# Altium schematic sheet ST_LINK-Wiki.SchDoc
size A4
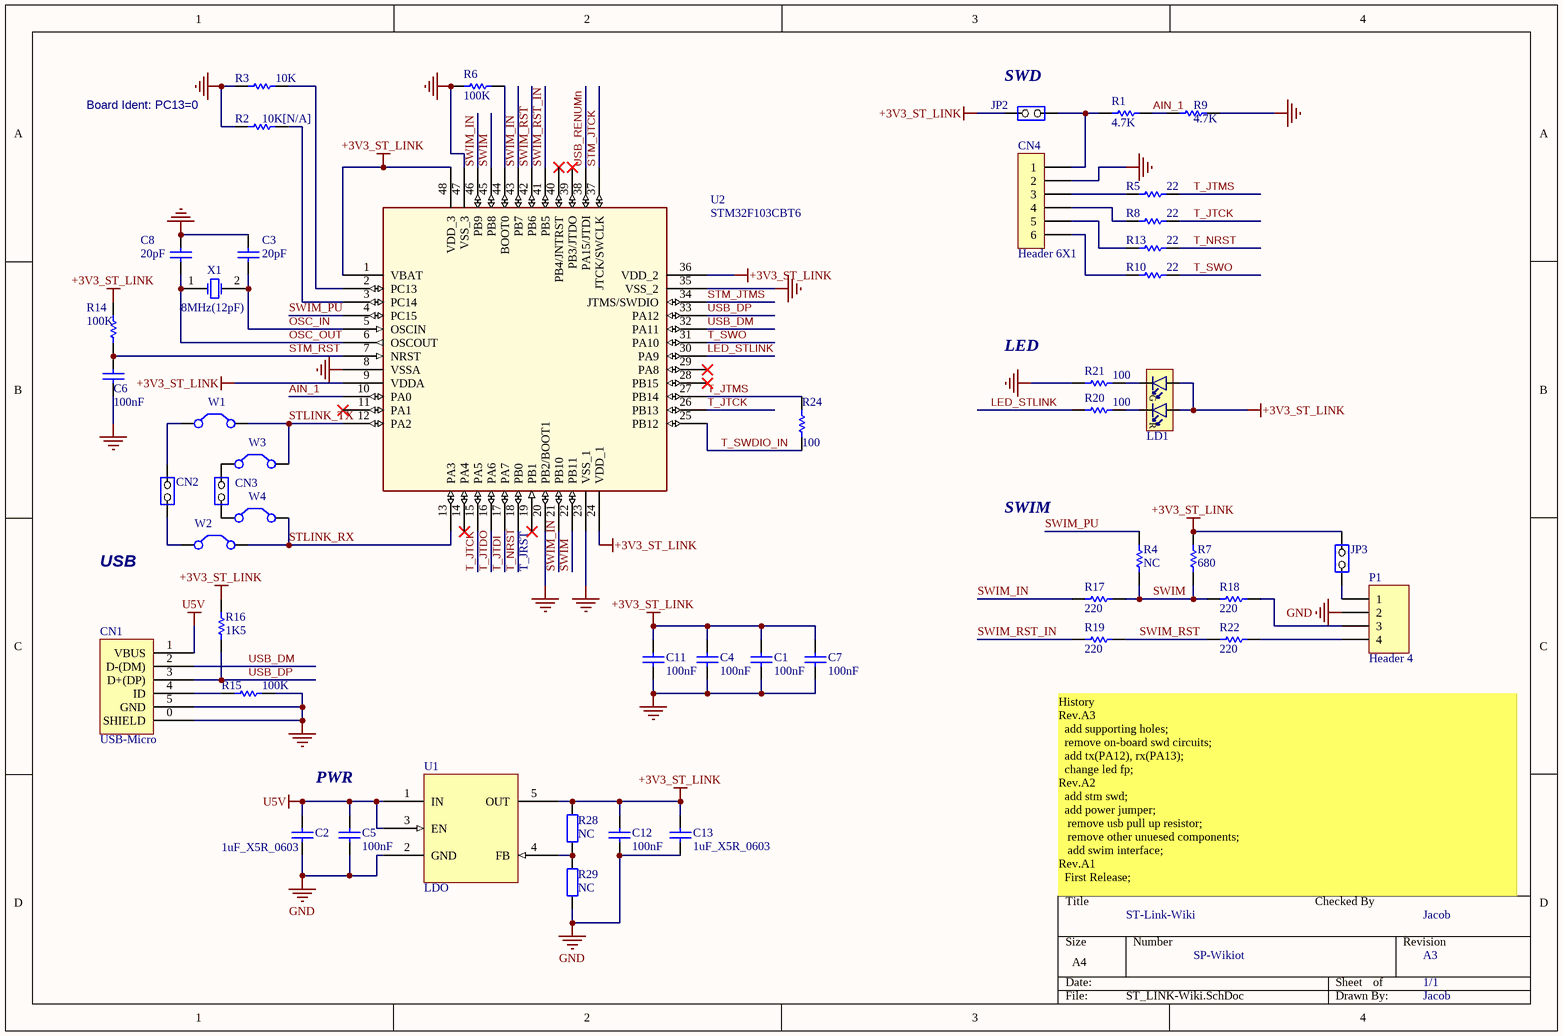
[diagram p0: ST_LINK-Wiki.SchDoc]

## Parts
C1  100nF  [0603C]
C2  1uF_X5R_0603  [0603C]
C3  20pF  [0603C]
C4  100nF  [0603C]
C5  100nF  [0603C]
C6  100nF  [0603C]
C7  100nF  [0603C]
C8  20pF  [0603C]
C11  100nF  [0603C]
C12  100nF  [0603C]
C13  1uF_X5R_0603  [0603C]
CN1  USB-Micro  [USB-MICRO-Lite]
CN2  (no value)  [HDR1X2-L/2.54MM]
CN3  (no value)  [HDR1X2-L/2.54MM]
CN4  Header 6X1  [HDR1X6-L/2.54MM]
JP2  (no value)  [HDR1X2/2.54mm]
JP3  (no value)  [HDR1X2/2.54mm]
LD1  LTST-C195KGJRKT  [0805-LED-Bi]  (value not drawn)
P1  Header 4  [HDR1X4-L/2.54MM]
R1  4.7K  [0603R]
R2  10K[N/A]  [0603R]
R3  10K  [0603R]
R4  NC  [0603R]
R5  22  [0603R]
R6  100K  [0603R]
R7  680  [0603R]
R8  22  [0603R]
R9  4.7K  [0603R]
R10  22  [0603R]
R13  22  [0603R]
R14  100K  [0603R]
R15  100K  [0603R]
R16  1K5  [0603R]
R17  220  [0603R]
R18  220  [0603R]
R19  220  [0603R]
R20  100  [0603R]
R21  100  [0603R]
R22  220  [0603R]
R24  100  [0603R]
R28  NC  [0603M]
R29  NC  [0603M]
U1  LDO  [SOT23-5]
U2  STM32F103CBT6  [QFP48 7X7]
W1  Jumper2-1  [JP2_SMD]  (value not drawn)
W2  Jumper2-1  [JP2_SMD]  (value not drawn)
W3  Jumper2-1  [JP2_SMD]  (value not drawn)
W4  Jumper2-1  [JP2_SMD]  (value not drawn)
X1  8MHz(12pF)  [XTAL1]

## Nets
+3V3_ST_LINK: C1.2 C4.2 C7.2 C11.2 C12.2 C13.1 JP2.1(COMMON) JP3.1(COMMON) LD1.3(A2) LD1.4(A1) R7.2 R14.2 R16.2 R28.1 U1.5(OUT) U2.1(VBAT) U2.9(VDDA) U2.24(VDD_1) U2.36(VDD_2) U2.48(VDD_3)
GND: C1.1 C2.1 C3.2 C4.1 C5.1 C6.1 C7.1 C8.2 C11.1 C12.1 C13.2 CN1.0(SHIELD) CN1.5(GND) CN4.2 P1.2 R2.1 R3.1 R6.1 R9.2 R15.2 R21.1 R29.1 U1.2(GND) U2.8(VSSA) U2.20(PB2/BOOT1) U2.23(VSS_1) U2.35(VSS_2) U2.47(VSS_3)
U5V: C2.2 C5.2 CN1.1(VBUS) U1.1(IN) U1.3(EN)
AIN_1: R1.1 R9.1 U2.10(PA0)
LED_STLINK: R20.1 U2.30(PA9)
OSC_IN: C3.1 U2.5(OSCIN) X1.2(OSC2)
OSC_OUT: C8.1 U2.6(OSCOUT) X1.1(OSC1)
STLINK_RX: U2.13(PA3) W2.2(C2) W4.2(C2)
STLINK_TX: U2.12(PA2) W1.2(C2) W3.2(C2)
STM_JTCK: U2.37(JTCK/SWCLK)
STM_JTMS: U2.34(JTMS/SWDIO)
STM_RST: C6.2 R14.1 U2.7(NRST)
SWIM: R4.1 R7.1 R17.2 R18.1 U2.22(PB11) U2.45(PB8)
SWIM_IN: R17.1 U2.21(PB10) U2.43(PB7) U2.46(PB9)
SWIM_PU: R4.2 U2.4(PC15)
SWIM_RST: R19.2 R22.1 U2.42(PB6)
SWIM_RST_IN: R19.1 U2.41(PB5)
T_JTCK: R8.2 U2.15(PA5) U2.26(PB13)
T_JTDI: U2.17(PA7)
T_JTDO: U2.16(PA6)
T_JTMS: R5.2 R24.2 U2.27(PB14)
T_NRST: R13.2 U2.18(PB0)
T_SWDIO_IN: R24.1 U2.25(PB12)
T_SWO: R10.2 U2.31(PA10)
USB_DM: CN1.2(D-(DM)) U2.32(PA11)
USB_DP: CN1.3(D+(DP)) R16.1 U2.33(PA12)
USB_RENUMn: U2.38(PA15/JTDI)
NetCN1_4: CN1.4(ID) R15.1
NetCN2_1: CN2.1(COMMON) W2.1(C1)
NetCN2_2: CN2.2(NO) W1.1(C1)
NetCN3_1: CN3.1(COMMON) W4.1(C1)
NetCN3_2: CN3.2(NO) W3.1(C1)
NetCN4_1: CN4.1 JP2.2(NO) R1.2
NetCN4_3: CN4.3 R5.1
NetCN4_4: CN4.4 R8.1
NetCN4_5: CN4.5 R13.1
NetCN4_6: CN4.6 R10.1
NetJP3_2: JP3.2(NO) P1.1
NetLD1_1: LD1.1(C1) R21.2
NetLD1_2: LD1.2(C2) R20.2
NetP1_3: P1.3 R18.2
NetP1_4: P1.4 R22.2
NetR2_2: R2.2 U2.3(PC14)
NetR3_2: R3.2 U2.2(PC13)
NetR6_2: R6.2 U2.44(BOOT0)
NetR28_2: R28.2 R29.2 U1.4(FB)

Not connected (* = marked no-connect by the designer): U2 11(PA1)* 14(PA4)* 19(PB1)* 28(PB15)* 29(PA8)* 39(PB3/JTDO)* 40(PB4/JNTRST)*

## Notes on the sheet
- Board Ident: PC13=0
- (near JP2) SWD
- LED
- SWIM
- USB
- (near U2) T_JRST
- PWR
- History
  Rev.A3
  add supporting holes;
  remove on-board swd circuits;
  add tx(PA12), rx(PA13);
  change led fp;
  Rev.A2
  add stm swd;
  add power jumper;
  remove usb pull up resistor;
  remove other unuesed components;
  add swim interface;
  Rev.A1
  First Release;
- ST-Link-Wiki
- Checked By
- Jacob
- SP-Wikiot
- A3
- 1/1
- (in symbol LED-DUAL) G; R

## Library data of the parts
C1 C4-C7 C11 C12 = Capacitor_ST: Capacitor 0402 / 0603 / 0805; Revision: July-2002: Re-released for DXP Platform.; Value: 100nF
C2 C13 = CAP SMD 0603  X5R 1礔 25V 10%: 0603  X5R 1礔; Rated voltage: 25V; Tolerance: 10%; Manufacturer: *; Manufacturer P/N: *; Order code Farnell: 1288202RL; Value: 1礔; Power: *; Technology: X5R; Temperature  Factor: *; Temperature Max: +125癈; Temperature Min: -55癈; STS Code: *
C3 C8 = Capacitor_ST: Capacitor 0402 / 0603 / 0805; Value: 100nF; Revision: July-2002: Re-released for DXP Platform.
CN2 CN3 = JP2: Fitted: NO
CN4 = Header 6X1: Header, 6-Pin, Single row; LatestRevisionDate: 17-Jul-2002; LatestRevisionNote: Re-released for DXP Platform.; Publisher: Altium Limited
JP2 JP3 = JP2
LD1 = LED-DUAL: Avago, HSMF-A203 Bi-Color LED; Manufacturer: Lite-On Inc; 2nd source part number: 859-LTST-C195KGJRKT; Note: HSMF-A203- xxxxx GaP Red GaP Emerald Green; Artikkelnr Noca: 13019145; Part Number: LTST-C195KGJRKT; Manufacturer Part Number: LTST-C195KGJRKT; Datasheet: http://media.digikey.com/pdf/Data%20Sheets/Lite-On%20PDFs/LTST-C195KGJRKT.pdf; Footprint: LED_DUAL_0606; LatestRevisionDate: 2012-07-05; Pin Count: 4; Publisher: Nordic Semiconductor; Published: 2012-07-05; Value: LTST-C195KGJRKT; Supplier: Digi-Key; Supplier part number: 160-1452-1-ND; 2nd source Supplier: Mouser
P1 = Header 4: Header, 4-Pin; LatestRevisionDate: 17-Jul-2002; LatestRevisionNote: Re-released for DXP Platform.; Publisher: Altium Limited
R1 R4-R10 R13-R22 R24 = Resistor_ST: Resistor 0402 / 0603 / 0805; Value: 10K
R2 = Resistor_ST: Resistor 0402 / 0603 / 0805; Value: 10K; Fitted: NO
R3 = Resistor_ST: Resistor 0402 / 0603 / 0805; Value: 10K
R28 R29 = Res2: Resistor; Published: 8-Jun-2000; LatestRevisionDate: 17-Jul-2002; LatestRevisionNote: Re-released for DXP Platform.; PackageReference: AXIAL-0.4; Publisher: Altium Limited; Value: NC
U1 = LDO-SOT23-5: General LDO SOT23-5
U2 = STM32F103CBT6: Medium-density performance line ARM-based 32-bit MCU with 64KB Flash; Manuf_Part_1: STM32F103C8T6; Manuf_1: STM; Ref St: 9175981; Provided: ST; ECCN_US/EU: 3A991A2/NEC; Distrib: ST; Order: STM32F103C8T6
W1-W4 = Jumper2-1: Jumper Wire; Published: 24-Mar-1999; LatestRevisionDate: 17-Jul-2002; LatestRevisionNote: Re-released for DXP Platform.; PackageReference: RAD-0.2; Publisher: Altium Limited
X1 = XTAL: Crystal Oscillator; Published: 8-Jun-2000; LatestRevisionDate: 17-Jul-2002; LatestRevisionNote: Re-released for DXP Platform.; PackageReference: R38; Publisher: Altium Limited